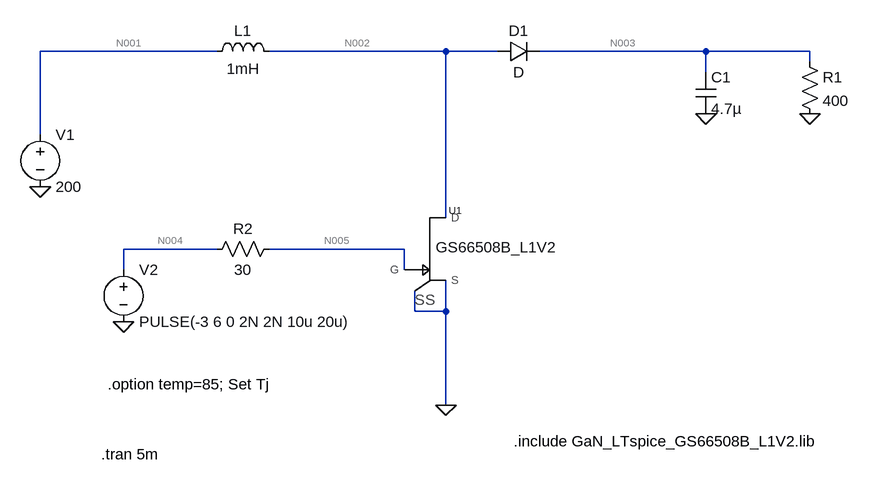
[diagram p0: schematic GaN.asc]
GaN.asc, the LTspice schematic file:
Version 4
SHEET 1 1460 680
WIRE -192 -560 -464 -560
WIRE 160 -560 -112 -560
WIRE 240 -560 160 -560
WIRE 560 -560 304 -560
WIRE 720 -560 560 -560
WIRE 720 -544 720 -560
WIRE 560 -528 560 -560
WIRE -464 -432 -464 -560
WIRE 160 -304 160 -560
WIRE -192 -256 -336 -256
WIRE 96 -256 -112 -256
WIRE -336 -224 -336 -256
WIRE 96 -224 96 -256
WIRE 112 -160 112 -192
WIRE 160 -160 160 -208
WIRE 160 -160 112 -160
WIRE 160 -16 160 -160
FLAG -336 -144 0
FLAG 160 -16 0
FLAG -464 -352 0
FLAG 560 -464 0
FLAG 720 -464 0
SYMBOL voltage -336 -240 R0
WINDOW 123 0 0 Left 2
WINDOW 39 0 0 Left 2
SYMATTR InstName V2
SYMATTR Value PULSE(-3 6 0 2N 2N 10u 20u)
SYMBOL res -96 -272 R90
WINDOW 0 0 56 VBottom 2
WINDOW 3 32 56 VTop 2
SYMATTR InstName R2
SYMATTR Value 30
SYMBOL GaN_E-HEMT_LT_GS66508B_L1V2 112 -256 R0
SYMATTR InstName U1
SYMBOL voltage -464 -448 R0
WINDOW 123 0 0 Left 2
WINDOW 39 0 0 Left 2
SYMATTR InstName V1
SYMATTR Value 200
SYMBOL diode 240 -544 R270
WINDOW 0 32 32 VTop 2
WINDOW 3 0 32 VBottom 2
SYMATTR InstName D1
SYMBOL cap 544 -528 R0
SYMATTR InstName C1
SYMATTR Value 4.7µ
SYMBOL res 704 -560 R0
SYMATTR InstName R1
SYMATTR Value 400
SYMBOL ind -208 -544 R270
WINDOW 0 32 56 VTop 2
WINDOW 3 5 56 VBottom 2
SYMATTR InstName L1
SYMATTR Value 1mH
TEXT 264 40 Left 2 !.include GaN_LTspice_GS66508B_L1V2.lib
TEXT -370 60 Left 2 !.tran 5m
TEXT -360 -48 Left 2 !.option temp=85; Set Tj

The netlist it stands for:
* GaN.asc
V2 N004 0 PULSE(-3 6 0 2N 2N 10u 20u)
R2 N005 N004 30
XU1 N005 N002 0 0 GS66508B_L1V2  ; pins G D S SS
V1 N001 0 200
D1 N002 N003 D
C1 N003 0 4.7µ
R1 N003 0 400
L1 N001 N002 1mH
.model D D
.lib standard.dio
.include GaN_LTspice_GS66508B_L1V2.lib
.tran 5m
.option temp=85; Set Tj
.lib GaN_LTspice_GS66508B_L1V2.lib
.backanno
.end

* Results of the author's LTspice run, read from the files saved beside the schematic
* Operating Point, zero values left out:
*   V(n004) = -3 V
*   V(n005) = -3 V
*   V(n002) = 200 V
*   V(n001) = 200 V
*   V(n003) = 199.3 V
*   I(D1) = 498.1 mA
*   I(L1) = 498.1 mA
*   I(R1) = 498.1 mA
*   I(R2) = 51.5 nA
*   I(V1) = -498.1 mA
*   I(V2) = 51.5 nA
*   Ix(u1:GATEIN) = -51.5 nA
*   Ix(u1:DRAININ) = 100.4 nA
*   Ix(u1:SOURCEIN) = -49.25 nA